# EAGLE design alex-gnd-station (EAGLE 9.6.2)
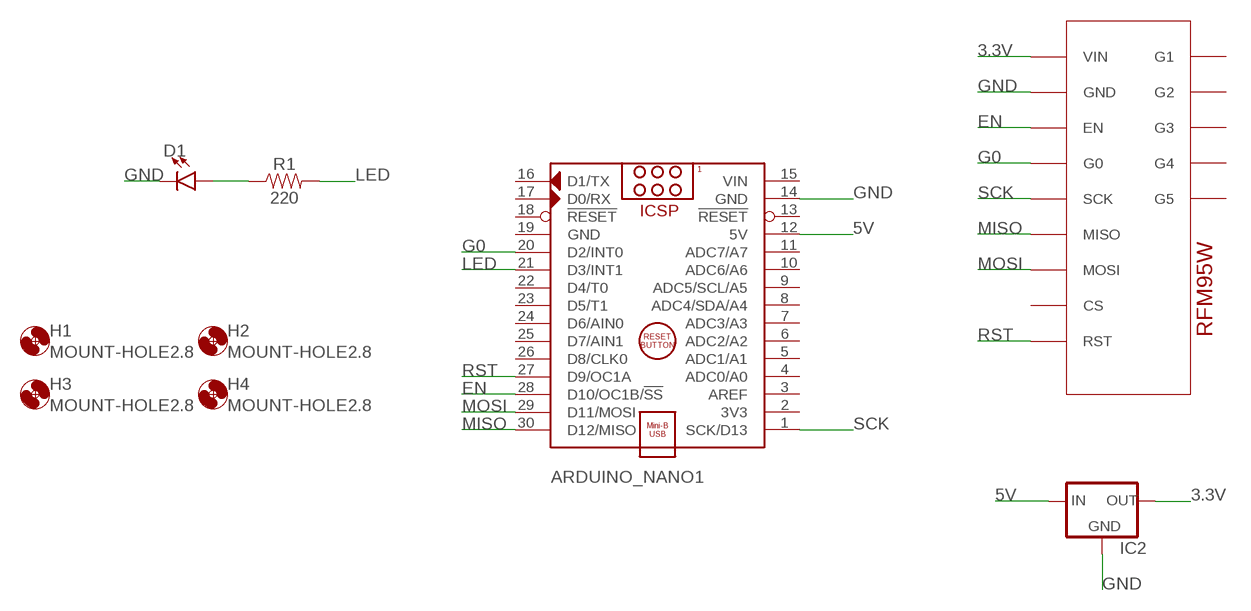
[diagram p0: schematic, sheet 1]

## Parts
ARDUINO_NANO1  ARDUINO_NANO  [ARDUINO_NANO]
D1  LED5MM  [LED_5MM]
H1  MOUNT-HOLE2.8  [2,8]
H2  MOUNT-HOLE2.8  [2,8]
H3  MOUNT-HOLE2.8  [2,8]
H4  MOUNT-HOLE2.8  [2,8]
IC2  78XXS  [78XXS]
R1  220  330OHM-HORIZ-1/10W-5%  [AXIAL-0.3]
U1  ADAFRUIT_RFM95W_LORA_RADIO  [ADAFRUIT_RFM95W_LORA_RADIO]

## Nets
3.3V: IC2.OUT U1.1(VIN)
5V: ARDUINO_NANO1.12(5V) IC2.IN
EN: ARDUINO_NANO1.28(D10/OC1B/!SS) U1.3(EN)
G0: ARDUINO_NANO1.20(D2/INT0) U1.4(G0)
GND: ARDUINO_NANO1.14(GND) D1.K(C) IC2.GND U1.2(GND)
LED: ARDUINO_NANO1.21(D3/INT1) R1.P$2
MISO: ARDUINO_NANO1.30(D12/MISO) U1.6(MISO)
MOSI: ARDUINO_NANO1.29(D11/MOSI) U1.7(MOSI)
N$1: D1.A R1.P$1
RST: ARDUINO_NANO1.27(D9/OC1A) U1.9(RST)
SCK: ARDUINO_NANO1.1(SCK/D13) U1.5(SCK)
Unconnected: ARDUINO_NANO1.2(3V3) ARDUINO_NANO1.3(AREF) ARDUINO_NANO1.4(ADC0/A0) ARDUINO_NANO1.5(ADC1/A1) ARDUINO_NANO1.6(ADC2/A2) ARDUINO_NANO1.7(ADC3/A3) ARDUINO_NANO1.8(ADC4/SDA/A4) ARDUINO_NANO1.9(ADC5/SCL/A5) ARDUINO_NANO1.10(ADC6/A6) ARDUINO_NANO1.11(ADC7/A7) ARDUINO_NANO1.13(!RESET) ARDUINO_NANO1.16(D1/TX) ARDUINO_NANO1.17(D0/RX) ARDUINO_NANO1.18(!RESET) ARDUINO_NANO1.22(D4/T0) ARDUINO_NANO1.23(D5/T1) ARDUINO_NANO1.24(D6/AIN0) ARDUINO_NANO1.25(D7/AIN1) ARDUINO_NANO1.26(D8/CLK0) U1.8(CS) U1.10(G1) U1.11(G2) U1.12(G3) U1.13(G4) U1.14(G5)

## Power pins joined to a net without a drawn wire
GND: ARDUINO_NANO1.19(GND)
VIN: ARDUINO_NANO1.15(VIN)

## Library data of the parts
ARDUINO_NANO1 = ArduinoNanoV30:ARDUINO_NANO: Arduino Nano V3.0 Module Overview: The Arduino Nano is a small, complete, and breadboard-friendly board based on the ATmega328 (Arduino Nano 3.x) or ATmega168 (Arduino Nano 2.x). It has more or less the same functionality of the Arduino Duemilanove, but in a different package. It lacks only a DC power jack, and works with a Mini-B USB cable instead of a standard one. The Nano was designed and is being produced by Gravitech <http://www.gravitech.us/arna30wiatp.html>. General specifications: Item Value Microcontroller Atmel ATmega168 or ATmega328 Operating Voltage (logic level) 5 V Input Voltage (recommended) 7-12 V Input Voltage (limits) 6-20 V Digital I/O Pins 14 (of which 6 provide PWM output) Analog Input Pins 8 DC Current per I/O Pin 40 mA Flash Memory 16 KB (ATmega168) or 32 KB (ATmega328) of which 2 KB used by bootloader SRAM 1 KB (ATmega168) or 2 KB (ATmega328) EEPROM 512 bytes (ATmega168) or 1 KB (ATmega328) Clock Speed 16 MHz Dimensions (Inches) 0.73" x 1.70" Dimensions (mm) 18mm x 45mm Overall height About 9 mm (not including pins) Weigth 5 g Power: The Arduino Nano can be powered via the Mini-B USB connection, 6-20V unregulated external power supply (pin 30), or 5V regulated external power supply (pin 27). The power source is automatically selected to the highest voltage source. Memory: The ATmega168 has 16 KB of flash memory for storing code (of which 2 KB is used for the bootloader); the ATmega328 has 32 KB, (also with 2 KB used for the bootloader). The ATmega168 has 1 KB of SRAM and 512 bytes of EEPROM (which can be read and written with the EEPROM library); the ATmega328 has 2 KB of SRAM and 1 KB of EEPROM. Input and Output: Each of the 14 digital pins on the Nano can be used as an input or output, using pinMode(), digitalWrite(), and digitalRead() functions. They operate at 5 volts. Each pin can provide or receive a maximum of 40 mA and has an internal pull-up resistor (disconnected by default) of 20-50 kOhms. In addition, some pins have specialized functions. Visit Arduino - ArduinoBoardNano <https://www.arduino.cc/en/Main/ArduinoBoardNano>
D1 = SparkFun-LED:LED: LED (Generic) Standard schematic elements and footprints for 5mm, 3mm, 1206, and 0603 sized LEDs. Generic LEDs with no color specified.
H1-H4 = holes:MOUNT-HOLE: MOUNTING HOLE with drill center marker
IC2 = v-reg:78XXS: VOLTAGE REGULATOR
R1 = SparkFun-Resistors:330OHM: 330Ω resistor A resistor is a passive two-terminal electrical component that implements electrical resistance as a circuit element. Resistors act to reduce current flow, and, at the same time, act to lower voltage levels within circuits. - Wikipedia; PROD_ID: RES-8371; VALUE: 330
U1 = AERO_Eagle_Library:ADAFRUIT_RFM95W_LORA_RADIO: Adafruit's LoRa Radio: RFM95W https://www.adafruit.com/product/3072

## Board
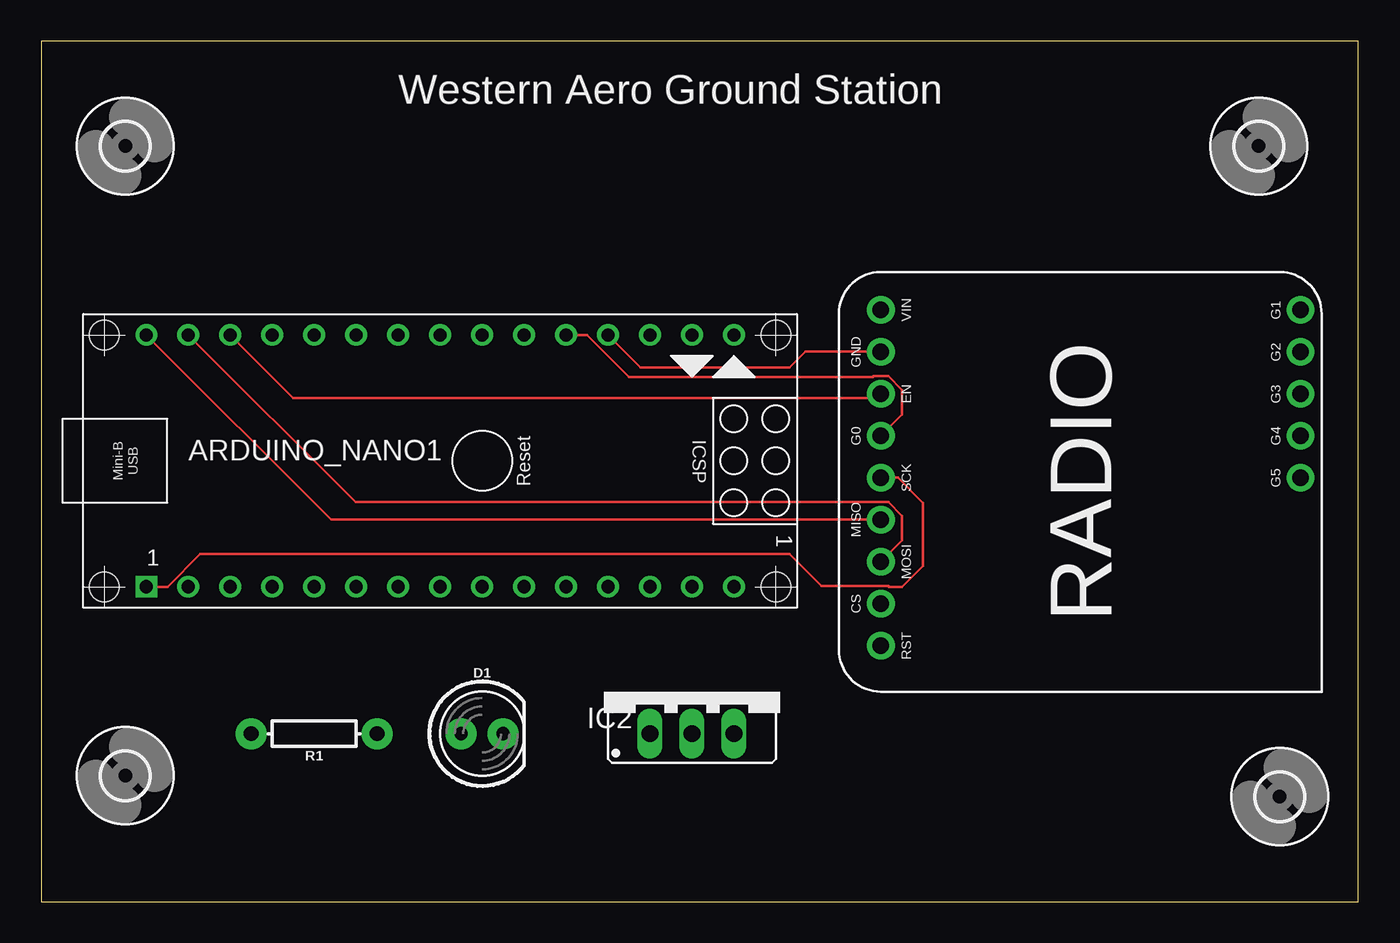
[diagram p1: board, top side]
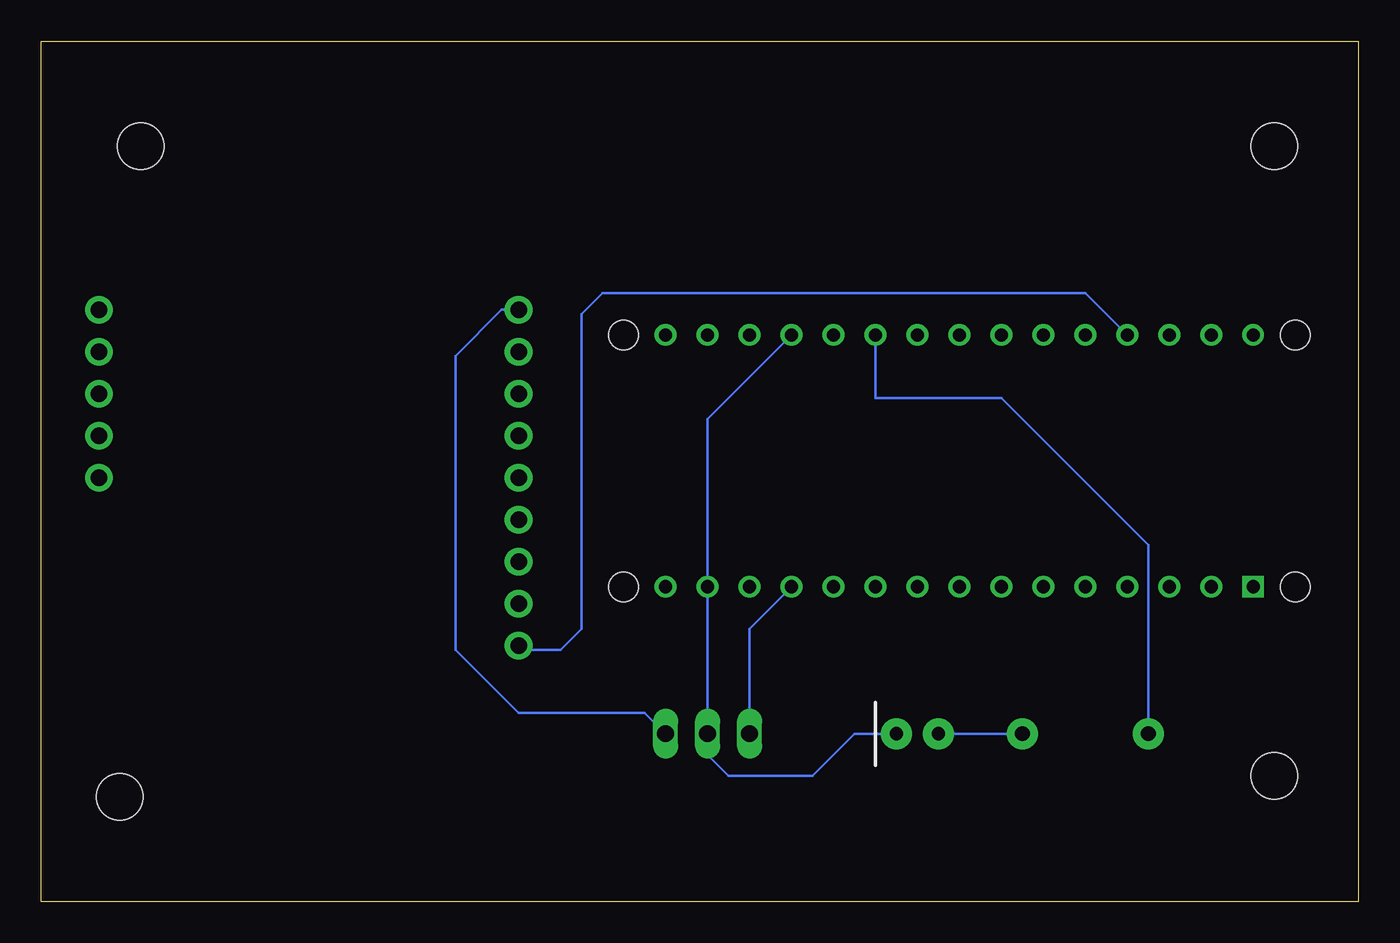
[diagram p2: board, bottom side, seen from below]

Size 79.68 x 52.06 mm. Coordinates in mm from the lower left corner, seen from the top.
Outline: 0,0 79.68,0 79.68,52.06 0,52.06 0,0
Copper layers (1*16): Top 0.035mm / dielectric 1.5mm / Bottom 0.035mm
Design rules "default": minimum track width 6mil, minimum drill 0.35mm, track to track 6mil, track to pad 6mil, pad to pad 6mil, via to via 6mil, smd to smd 6mil, copper to edge 40mil, drill to drill 6mil, minimum pad ring 10mil, minimum via ring 8mil, stop-mask expansion 4mil, vias tented up to drill 0mil, thermal gap 10mil

### Footprints (pad centres in the part's own frame; a part is rotated, then mirrored left to right if it is on the bottom)
ARDUINO_NANO = drill 0.8 square: 1 -20.32,-7.62 | drill 0.8: 2 -17.78,-7.62; 3 -15.24,-7.62; 4 -12.7,-7.62; 5 -10.16,-7.62; 6 -7.62,-7.62; 7 -5.08,-7.62; 8 -2.54,-7.62; 9 0,-7.62; 10 2.54,-7.62; 11 5.08,-7.62; 12 7.62,-7.62; 13 10.16,-7.62; 14 12.7,-7.62; 15 15.24,-7.62; 16 15.24,7.62; 17 12.7,7.62; 18 10.16,7.62; 19 7.62,7.62; 20 5.08,7.62; 21 2.54,7.62; 22 0,7.62; 23 -2.54,7.62; 24 -5.08,7.62; 25 -7.62,7.62; 26 -10.16,7.62; 27 -12.7,7.62; 28 -15.24,7.62; 29 -17.78,7.62; 30 -20.32,7.62 | hole 1.778: -22.86,-7.62; -22.86,7.62; 17.78,7.62; 17.78,-7.62
LED_5MM = drill 0.813 pad 1.88: A -1.27,0; K 1.27,0
2,8 = hole 2.8: 0,0
78XXS = drill 1.016 long: GND 0,-2.54; IN -2.54,-2.54; OUT 2.54,-2.54
AXIAL-0.3 = drill 0.9 pad 1.88: P$1 -3.81,0; P$2 3.81,0
ADAFRUIT_RFM95W_LORA_RADIO = drill 1 pad 1.676: 1 2.29,-26.67; 2 4.83,-26.67; 3 7.37,-26.67; 4 9.91,-26.67; 5 12.45,-26.67; 6 14.99,-26.67; 7 17.53,-26.67; 8 20.07,-26.67; 9 22.61,-26.67; 10 2.29,-1.27; 11 4.83,-1.27; 12 7.37,-1.27; 13 9.91,-1.27; 14 12.45,-1.27

### Placement (x,y rotation side)
ARDUINO_NANO1  26.67,26.67 0 top
D1  26.67,10.16 0 top
H1  5.08,45.72 0 top
H2  73.66,45.72 0 top
H3  74.93,6.35 0 top
H4  5.08,7.62 0 top
IC2  39.37,12.7 0 top
R1  16.51,10.16 180 top
U1  77.47,38.1 270 top

### Tracks (layer width: path | path; a pad name or v marks a point on that pad's centre or on a via)
3.3V
  Bottom 0.152: IC2.OUT 43.18,11.43 50.8,11.43 54.61,15.24 54.61,33.02 51.82,35.81 U1.1
5V
  Bottom 0.152: ARDUINO_NANO1.12 36.83,16.51 IC2.IN
EN
  Top 0.152: ARDUINO_NANO1.28 15.24,30.48 50.55,30.48 U1.3
G0
  Top 0.152: ARDUINO_NANO1.20 33.02,34.29 35.56,31.75 50.31,31.75 50.36,31.8 51.24,31.8 52.07,30.97 52.07,29.46 U1.4
GND
  Top 0.152: U1.2 46.23,33.27 45.27,32.31 36.27,32.31 ARDUINO_NANO1.19
  Bottom 0.152: D1.K 30.48,10.16 33.02,7.62 38.1,7.62 39.37,8.89 IC2.GND ARDUINO_NANO1.14 39.37,29.21 ARDUINO_NANO1.19
LED
  Bottom 0.152: R1.P$2 12.7,21.59 21.59,30.48 29.21,30.48 ARDUINO_NANO1.21
MISO
  Top 0.152: U1.6 17.53,23.11 ARDUINO_NANO1.30
MOSI
  Top 0.152: ARDUINO_NANO1.29 19,24.18 51.24,24.18 52.07,23.35 52.07,21.84 U1.7
N$1
  Bottom 0.152: R1.P$1 D1.A
RST
  Bottom 0.152: ARDUINO_NANO1.27 16.51,36.83 45.72,36.83 46.99,35.56 46.99,16.51 48.26,15.24 50.55,15.24 U1.9
SCK
  Top 0.152: ARDUINO_NANO1.1 7.64,19.05 9.62,21.03 45.27,21.03 47.2,19.1 51.24,19.1 51.29,19.05 52.07,19.05 53.34,20.32 53.34,24.13 51.82,25.65 U1.5

### Text on the board
tPlace: Western Aero Ground Station